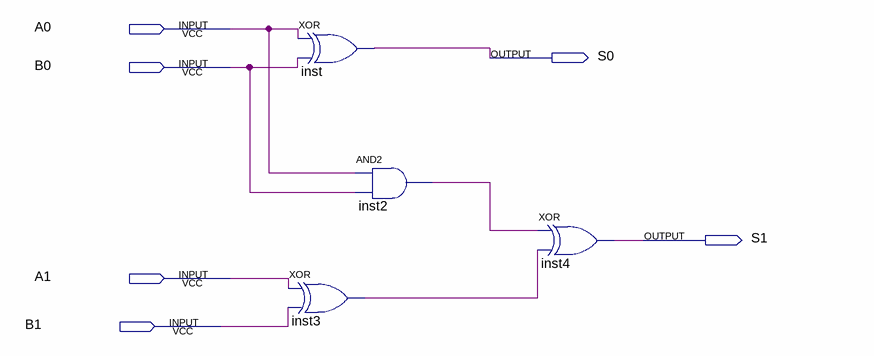
[diagram p0: schematic sheet]
// Quartus schematic Adder4bit.bdf as structural Verilog: 4 symbols, 6 pins
module Adder4bit (
  input  A0,
  input  B0,
  input  A1,
  input  B1,
  output S0,
  output S1
);

  wire inst2_out, inst3_out;

  xor inst (S0, A0, B0);
  xor inst3 (inst3_out, A1, B1);
  and inst2 (inst2_out, A0, B0);
  xor inst4 (S1, inst2_out, inst3_out);
endmodule
